# EAGLE design Digital Thermometer Schematic (EAGLE 9.6.2)
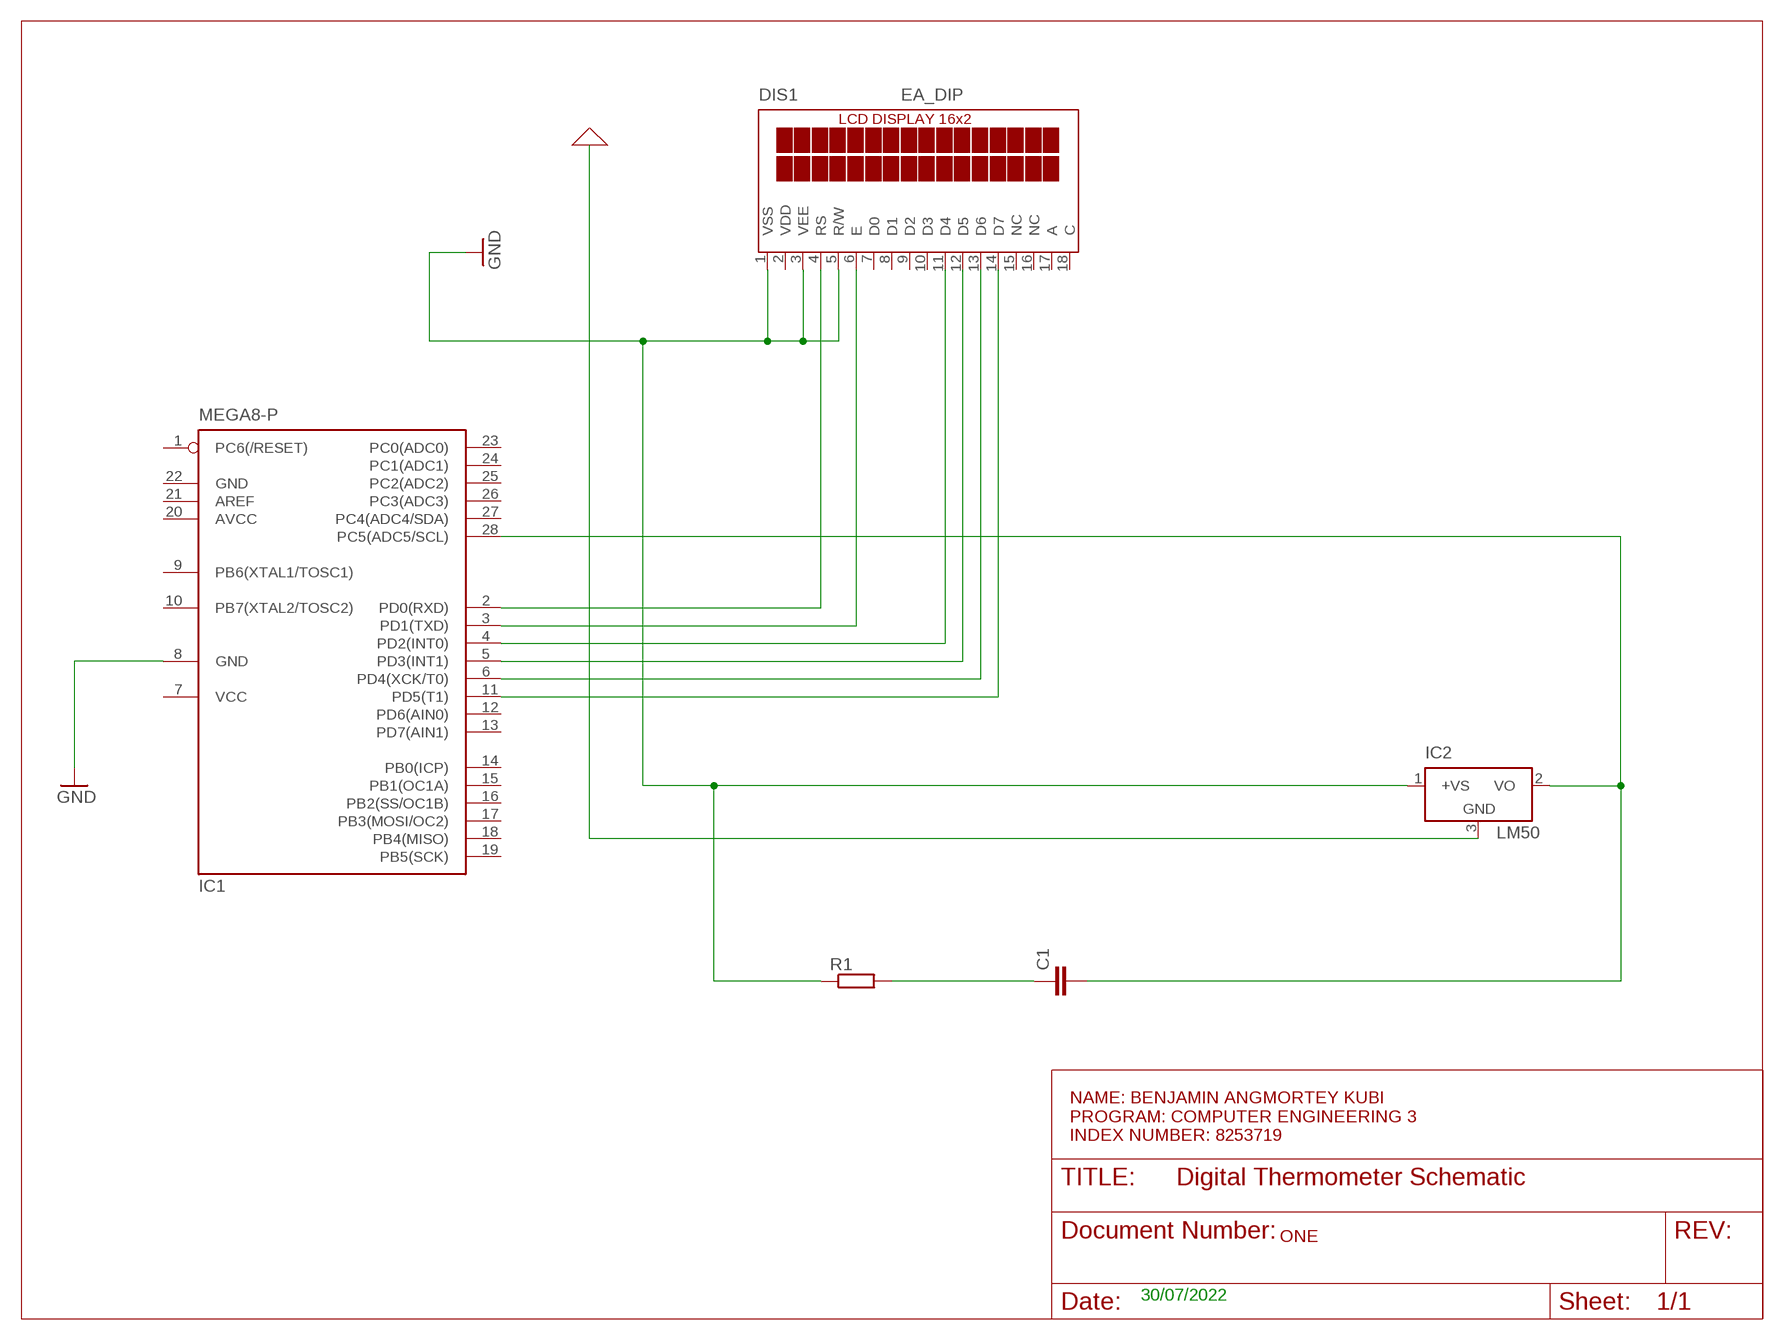
[diagram p0: schematic, sheet 1]

## Parts
C1  C-EU025-024X044  [C025-024X044]
DIS1  EA_DIP  [EA_DIP]
IC1  MEGA8-P  [DIL28-3]
IC2  LM50  [SOT23]
R1  R-EU_0207/10  [0207/10]

## Nets
0: IC2.3(GND) ; supply symbol labelled GND
GND: DIS1.1(VSS) DIS1.3(VEE) DIS1.5(R/W) IC1.8(GND) IC2.1(+VS) R1.1
N$1: DIS1.4(RS) IC1.2(PD0(RXD))
N$2: DIS1.6(E) IC1.3(PD1(TXD))
N$3: DIS1.11(D4) IC1.4(PD2(INT0))
N$4: DIS1.12(D5) IC1.5(PD3(INT1))
N$5: DIS1.13(D6) IC1.6(PD4(XCK/T0))
N$6: DIS1.14(D7) IC1.11(PD5(T1))
N$7: C1.2 IC1.28(PC5(ADC5/SCL)) IC2.2(VO)
N$8: C1.1 R1.2
Unconnected: DIS1.7(D0) DIS1.8(D1) DIS1.9(D2) DIS1.10(D3) DIS1.15(NC) DIS1.16(NC) DIS1.17(A) DIS1.18(C) IC1.1(PC6(/RESET)) IC1.9(PB6(XTAL1/TOSC1)) IC1.10(PB7(XTAL2/TOSC2)) IC1.12(PD6(AIN0)) IC1.13(PD7(AIN1)) IC1.14(PB0(ICP)) IC1.15(PB1(OC1A)) IC1.16(PB2(SS/OC1B)) IC1.17(PB3(MOSI/OC2)) IC1.18(PB4(MISO)) IC1.19(PB5(SCK)) IC1.21(AREF) IC1.23(PC0(ADC0)) IC1.24(PC1(ADC1)) IC1.25(PC2(ADC2)) IC1.26(PC3(ADC3)) IC1.27(PC4(ADC4/SDA))

## Notes on the sheet
- NAME: BENJAMIN ANGMORTEY KUBI
  PROGRAM: COMPUTER ENGINEERING 3
  INDEX NUMBER: 8253719
- ONE
- 30/07/2022

## Power pins joined to a net without a drawn wire
AVCC: IC1.20(AVCC)
GND: IC1.22(GND)
VCC: IC1.7(VCC)
VDD: DIS1.2(VDD)

## Library data of the parts
C1 = rcl:C-EU: CAPACITOR, European symbol; SPICEPREFIX: C
DIS1 = display-lcd:EA_DIP: LCD-MODUL 2x16 - 6,68mm, INKL. KONTROLLER HD44780 Source: Data sheet <http://www.lcd-module.de/pdf/doma/dip162-d.pdf>
IC1 = atmel:MEGA8-P: MICROCONTROLLER 8 Kbytes FLASH, 1 kbytes SRAM, 512 bytes EEPROM, USART, 4-channel 10 bit ADC, 2-channel 8 bit ADC Pin compatible with Atmega48, ATMega88, ATMega168 Source: avr.lbr; OC_FARNELL: unknown; OC_NEWARK: unknown
IC2 = linear:LM50: SOT-23 Single-Supply Centigrade Temperature Sensor Vout = (10mV/°C x Temp °C) +5mmmV Source: http://cache.national.com/ds/LM/LM50.pdf
R1 = rcl:R-EU_: RESISTOR, European symbol; SPICEPREFIX: R

## Board
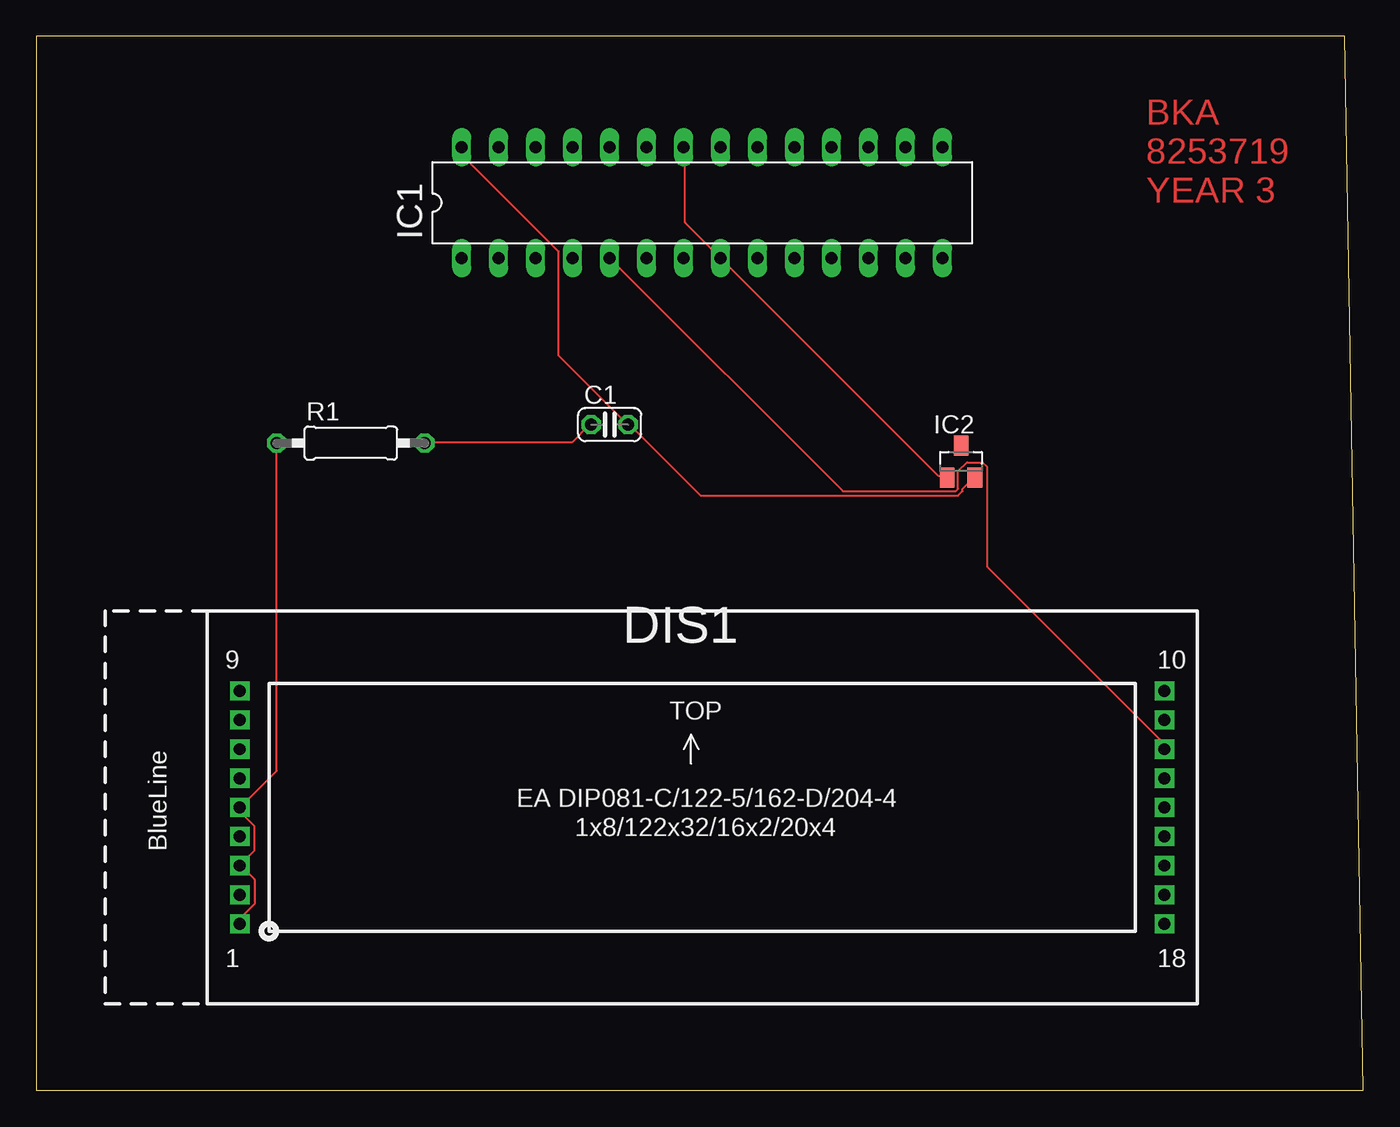
[diagram p1: board, top side]
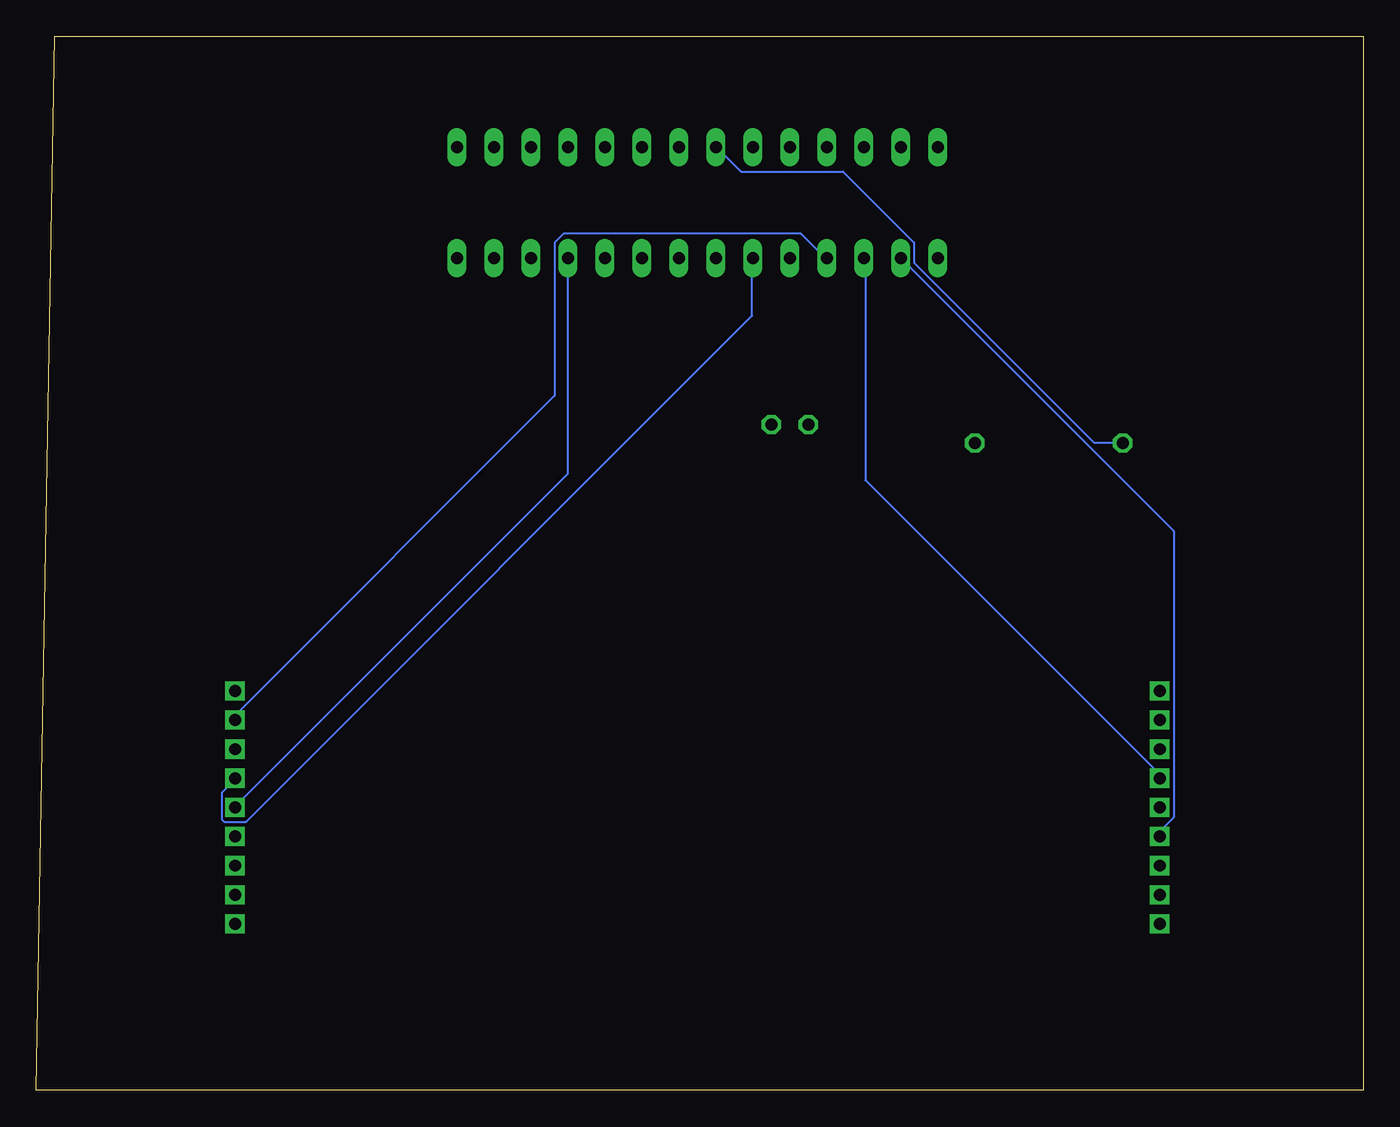
[diagram p2: board, bottom side, seen from below]

Size 91.11 x 72.38 mm. Coordinates in mm from the lower left corner, seen from the top.
Outline: 0,0 91.11,0 89.84,72.38 0,72.38 0,0
Copper layers (1*16): Top 0.035mm / dielectric 1.5mm / Bottom 0.035mm
Design rules "default": minimum track width 6mil, minimum drill 0.35mm, track to track 6mil, track to pad 6mil, pad to pad 6mil, via to via 6mil, smd to smd 6mil, copper to edge 40mil, drill to drill 6mil, minimum pad ring 10mil, minimum via ring 8mil, stop-mask expansion 4mil, vias tented up to drill 0mil, thermal gap 10mil

### Footprints (pad centres in the part's own frame; a part is rotated, then mirrored left to right if it is on the bottom)
C025-024X044 = drill 0.813 octagon: 1 -1.27,0; 2 1.27,0
EA_DIP = drill 0.813 pad 1.27 square: 1 0,0; 2 0,2; 3 0,4; 4 0,6; 5 0,8; 6 0,10; 7 0,12; 8 0,14; 9 0,16; 10 63.5,16; 11 63.5,14; 12 63.5,12; 13 63.5,10; 14 63.5,8; 15 63.5,6; 16 63.5,4; 17 63.5,2; 18 63.5,0
DIL28-3 = drill 0.813 long: 1 -16.51,-3.81; 2 -13.97,-3.81; 3 -11.43,-3.81; 4 -8.89,-3.81; 5 -6.35,-3.81; 6 -3.81,-3.81; 7 -1.27,-3.81; 8 1.27,-3.81; 9 3.81,-3.81; 10 6.35,-3.81; 11 8.89,-3.81; 12 11.43,-3.81; 13 13.97,-3.81; 14 16.51,-3.81; 15 16.51,3.81; 16 13.97,3.81; 17 11.43,3.81; 18 8.89,3.81; 19 6.35,3.81; 20 3.81,3.81; 21 1.27,3.81; 22 -1.27,3.81; 23 -3.81,3.81; 24 -6.35,3.81; 25 -8.89,3.81; 26 -11.43,3.81; 27 -13.97,3.81; 28 -16.51,3.81
SOT23 = smd 1 x 1.4: 1 -0.95,-1.1; 2 0.95,-1.1; 3 0,1.1
0207/10 = drill 0.813 octagon: 1 -5.08,0; 2 5.08,0

### Placement (x,y rotation side)
C1  39.37,45.72 0 top
DIS1  13.97,11.43 0 top
IC1  45.72,60.96 0 top
IC2  63.5,43.18 0 top
R1  21.59,44.45 0 top

### Tracks (layer width: path | path; a pad name or v marks a point on that pad's centre or on a via)
GND
  Top 0.152: DIS1.1 14.07,11.43 14.07,11.89 14.99,12.8 14.99,14.48 14.07,15.39 DIS1.3 14.07,15.54 14.99,16.46 14.99,18.14 14.07,19.05 14.07,19.36 DIS1.5 14.07,19.51 16.51,21.95 R1.1 | IC2.1 62.53,42.22 61.92,42.22 IC1.8 44.55,59.59 44.55,64.77 IC1.22
  Bottom 0.152: R1.1 16.51,44.5 18.49,44.5 30.84,56.84 30.84,58.22 35.71,63.09 42.72,63.09 44.4,64.77 IC1.22
N$1
  Bottom 0.152: IC1.2 13,38.41 13,18.75 13.92,17.83 13.92,17.53 DIS1.4
N$2
  Bottom 0.152: DIS1.6 14.07,21.49 14.07,21.79 34.19,41.91 34.19,57.15 IC1.3
N$3
  Bottom 0.152: DIS1.11 77.47,25.76 55.52,47.7 55.52,58.22 54.92,58.83 38.61,58.83 36.93,57.15 IC1.4
N$4
  Top 0.152: DIS1.12 77.47,23.77 65.28,35.97 65.28,42.82 64.97,43.13 63.91,43.13 63.3,42.52 63.3,41.3 63.14,41.15 55.37,41.15 IC1.5
N$5
  Bottom 0.152: IC1.6 41.96,57.15 41.96,53.19 76.71,18.44 78.23,18.44 78.38,18.59 78.38,20.42 77.47,21.34 DIS1.13
N$6
  Bottom 0.152: IC1.11 54.61,42.37 77.47,19.51 DIS1.14
N$7
  Top 0.152: IC2.2 64.36,42.06 63.6,41.3 63.6,41.15 63.3,40.84 45.62,40.84 40.74,45.72 C1.2 40.59,45.72 35.86,50.44 35.86,57.61 29.31,64.16 29.31,64.77 IC1.28
N$8
  Top 0.152: R1.2 26.72,44.5 36.78,44.5 38,45.72 C1.1

### Text on the board
Top: BKA / 8253719 / YEAR 3